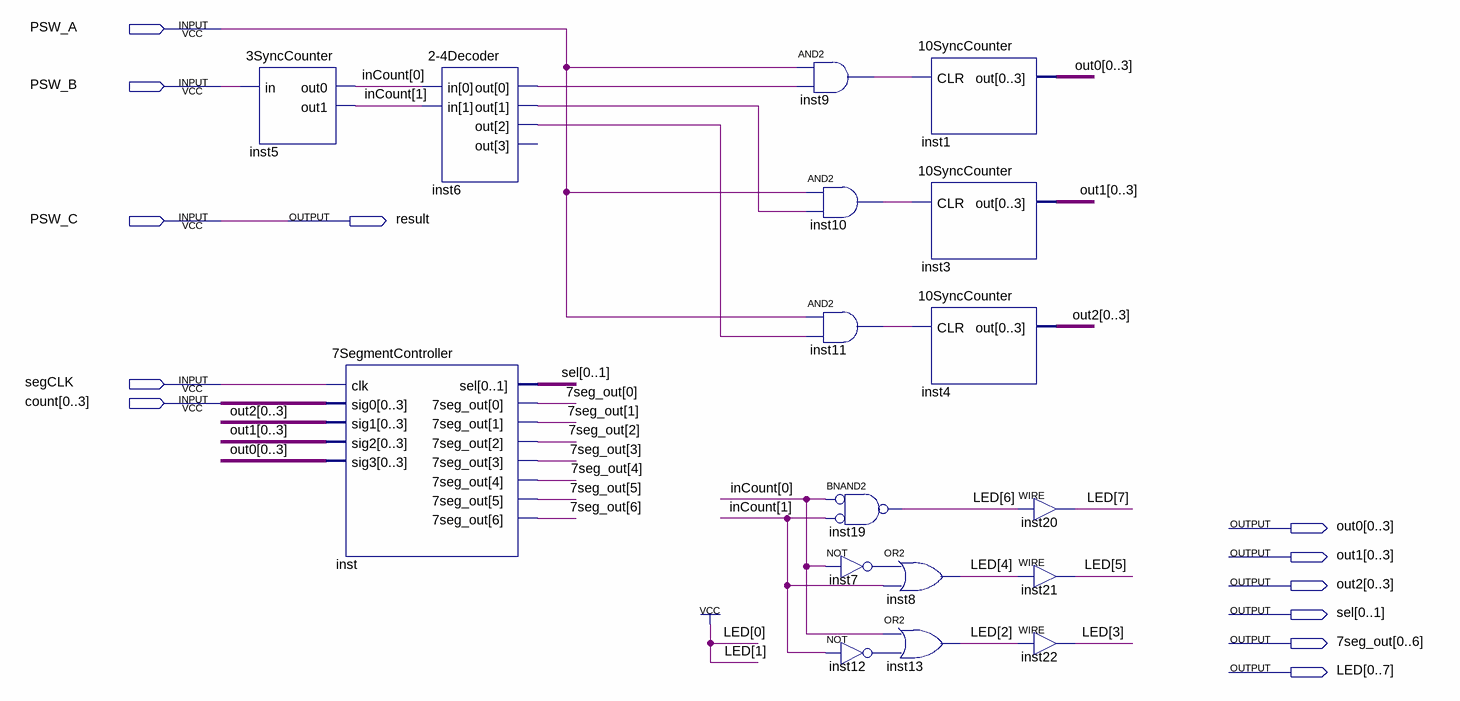
[diagram p0: schematic sheet]
// Quartus schematic InputNumber.bdf as structural Verilog: 17 symbols, 12 pins
module InputNumber (
  input  PSW_A,
  input  PSW_B,
  input  PSW_C,
  input  segCLK,
  input  [0:3] count,
  output result,
  output [0:3] out0,
  output [0:3] out1,
  output [0:3] out2,
  output [0:1] sel,
  output [0:6] \7seg_out ,
  output [0:7] LED
);

  wire inst6_out, inst6_out_2, inst6_out_3, inst7_out, inst9_out, inst10_out, inst11_out, inst12_out;
  wire [1:0] inCount;
  wire [3:0] inst6_out_open;  // unused outputs

  \3SyncCounter  inst5 (.in(PSW_B), .out0(inCount[0]), .out1(inCount[1]));
  \7SegmentController  inst (
    .clk(segCLK), .sig0(count), .sig1(out2), .sig2(out1), .sig3(out0), .sel(sel),
    .\7seg_out ({\7seg_out [6], \7seg_out [5], \7seg_out [4], \7seg_out [3], \7seg_out [2], \7seg_out [1], \7seg_out [0]}));
  \2-4Decoder  inst6 (.in(inCount), .out({inst6_out_open[3], inst6_out_3, inst6_out_2, inst6_out}));
  and inst9 (inst9_out, PSW_A, inst6_out);
  and inst10 (inst10_out, PSW_A, inst6_out_2);
  and inst11 (inst11_out, PSW_A, inst6_out_3);
  nand inst19 (LED[6], ~inCount[0], ~inCount[1]);  // BNAND2
  not inst7 (inst7_out, inCount[0]);
  or inst8 (LED[4], inst7_out, inCount[1]);
  or inst13 (LED[2], inCount[0], inst12_out);
  not inst12 (inst12_out, inCount[1]);
  \10SyncCounter  inst1 (.CLR(inst9_out), .out(out0));
  \10SyncCounter  inst3 (.CLR(inst10_out), .out(out1));
  \10SyncCounter  inst4 (.CLR(inst11_out), .out(out2));
  assign LED[7] = LED[6];  // WIRE inst20
  assign LED[5] = LED[4];  // WIRE inst21
  assign LED[3] = LED[2];  // WIRE inst22

  assign LED[0:1] = 2'b11;
  assign result = PSW_C;
endmodule
